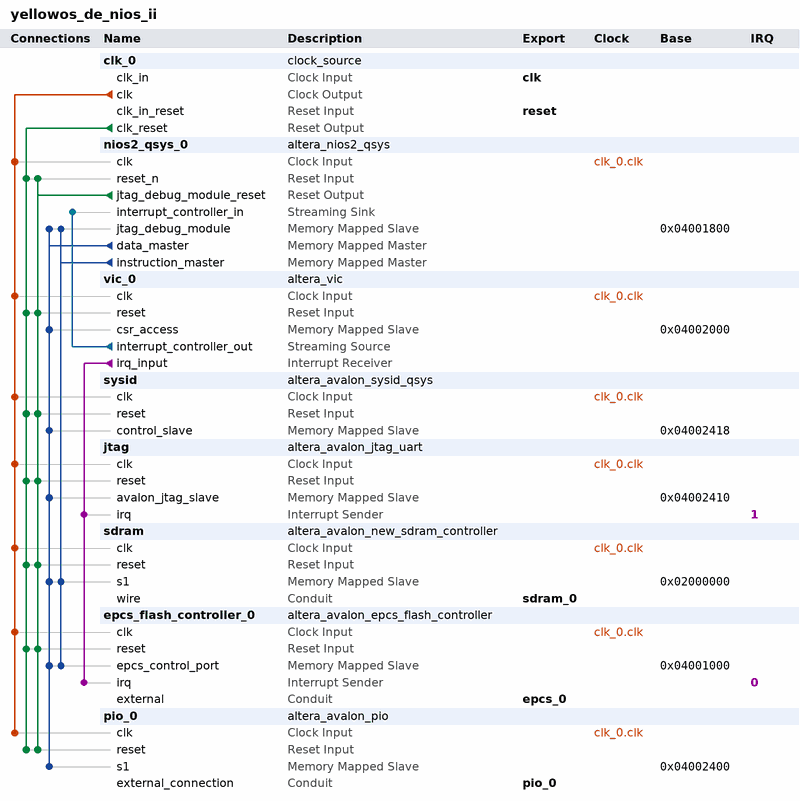
[diagram p0: system contents]
# Platform Designer (Qsys) system yellowos_de_nios_ii, Cyclone IV E EP4CE22F17C6
# Parameters at their usual value, and those the tool derives, are not listed.
package require -exact qsys 17.0
create_system yellowos_de_nios_ii
set_project_property DEVICE_FAMILY {Cyclone IV E}
set_project_property DEVICE EP4CE22F17C6

add_instance clk_0 clock_source 17.0
set_instance_parameter_value clk_0 clockFrequency 66666667

add_instance nios2_qsys_0 altera_nios2_qsys 16.1
set_instance_parameter_value nios2_qsys_0 breakSlave nios2_qsys_0.jtag_debug_module
set_instance_parameter_value nios2_qsys_0 exceptionSlave sdram.s1
set_instance_parameter_value nios2_qsys_0 icache_size 4096
set_instance_parameter_value nios2_qsys_0 impl Fast
set_instance_parameter_value nios2_qsys_0 mmu_TLBMissExcSlave None
set_instance_parameter_value nios2_qsys_0 resetSlave epcs_flash_controller_0.epcs_control_port
set_instance_parameter_value nios2_qsys_0 resetrequest_enabled true
set_instance_parameter_value nios2_qsys_0 setting_interruptControllerType External
set_instance_parameter_value nios2_qsys_0 setting_shadowRegisterSets 8

add_instance vic_0 altera_vic 17.0
set_instance_parameter_value vic_0 DAISY_CHAIN_ENABLE 0
set_instance_parameter_value vic_0 INTERRUPT_LATENCY_CYCLES 2
set_instance_parameter_value vic_0 NUMBER_OF_INT_PORTS 8
set_instance_parameter_value vic_0 OVERRIDE_INTERRUPT_LATENCY false
set_instance_parameter_value vic_0 RIL_WIDTH 4

add_instance sysid altera_avalon_sysid_qsys 17.0
set_instance_parameter_value sysid id 74496

add_instance jtag altera_avalon_jtag_uart 17.0
set_instance_parameter_value jtag simInteractiveOptions NO_INTERACTIVE_WINDOWS

add_instance sdram altera_avalon_new_sdram_controller 17.0
set_instance_parameter_value sdram TAC 5.5
set_instance_parameter_value sdram TRCD 20.0
set_instance_parameter_value sdram TRP 20.0
set_instance_parameter_value sdram casLatency 3
set_instance_parameter_value sdram columnWidth 9
set_instance_parameter_value sdram dataWidth 16
set_instance_parameter_value sdram generateSimulationModel false
set_instance_parameter_value sdram model single_Micron_MT48LC4M32B2_7_chip
set_instance_parameter_value sdram numberOfBanks 4
set_instance_parameter_value sdram numberOfChipSelects 1
set_instance_parameter_value sdram powerUpDelay 100.0
set_instance_parameter_value sdram refreshPeriod 15.625
set_instance_parameter_value sdram rowWidth 13

add_instance epcs_flash_controller_0 altera_avalon_epcs_flash_controller 17.0
set_instance_parameter_value epcs_flash_controller_0 resetrequest_enabled true

add_instance pio_0 altera_avalon_pio 17.0
set_instance_parameter_value pio_0 direction Output
set_instance_parameter_value pio_0 width 8

# connections
add_connection clk_0.clk epcs_flash_controller_0.clk clock
add_connection clk_0.clk jtag.clk clock
add_connection clk_0.clk nios2_qsys_0.clk clock
add_connection clk_0.clk pio_0.clk clock
add_connection clk_0.clk sdram.clk clock
add_connection clk_0.clk sysid.clk clock
add_connection clk_0.clk vic_0.clk clock
add_connection clk_0.clk_reset epcs_flash_controller_0.reset reset
add_connection clk_0.clk_reset jtag.reset reset
add_connection clk_0.clk_reset nios2_qsys_0.reset_n reset
add_connection clk_0.clk_reset pio_0.reset reset
add_connection clk_0.clk_reset sdram.reset reset
add_connection clk_0.clk_reset sysid.reset reset
add_connection clk_0.clk_reset vic_0.reset reset
add_connection nios2_qsys_0.jtag_debug_module_reset epcs_flash_controller_0.reset reset
add_connection nios2_qsys_0.jtag_debug_module_reset jtag.reset reset
add_connection nios2_qsys_0.jtag_debug_module_reset nios2_qsys_0.reset_n reset
add_connection nios2_qsys_0.jtag_debug_module_reset pio_0.reset reset
add_connection nios2_qsys_0.jtag_debug_module_reset sdram.reset reset
add_connection nios2_qsys_0.jtag_debug_module_reset sysid.reset reset
add_connection nios2_qsys_0.jtag_debug_module_reset vic_0.reset reset
add_connection nios2_qsys_0.data_master epcs_flash_controller_0.epcs_control_port avalon
set_connection_parameter_value nios2_qsys_0.data_master/epcs_flash_controller_0.epcs_control_port baseAddress 0x04001000
add_connection nios2_qsys_0.data_master jtag.avalon_jtag_slave avalon
set_connection_parameter_value nios2_qsys_0.data_master/jtag.avalon_jtag_slave baseAddress 0x04002410
add_connection nios2_qsys_0.data_master nios2_qsys_0.jtag_debug_module avalon
set_connection_parameter_value nios2_qsys_0.data_master/nios2_qsys_0.jtag_debug_module baseAddress 0x04001800
add_connection nios2_qsys_0.data_master pio_0.s1 avalon
set_connection_parameter_value nios2_qsys_0.data_master/pio_0.s1 baseAddress 0x04002400
add_connection nios2_qsys_0.data_master sdram.s1 avalon
set_connection_parameter_value nios2_qsys_0.data_master/sdram.s1 baseAddress 0x02000000
add_connection nios2_qsys_0.data_master sysid.control_slave avalon
set_connection_parameter_value nios2_qsys_0.data_master/sysid.control_slave baseAddress 0x04002418
add_connection nios2_qsys_0.data_master vic_0.csr_access avalon
set_connection_parameter_value nios2_qsys_0.data_master/vic_0.csr_access baseAddress 0x04002000
add_connection nios2_qsys_0.instruction_master epcs_flash_controller_0.epcs_control_port avalon
set_connection_parameter_value nios2_qsys_0.instruction_master/epcs_flash_controller_0.epcs_control_port baseAddress 0x04001000
add_connection nios2_qsys_0.instruction_master nios2_qsys_0.jtag_debug_module avalon
set_connection_parameter_value nios2_qsys_0.instruction_master/nios2_qsys_0.jtag_debug_module baseAddress 0x04001800
add_connection nios2_qsys_0.instruction_master sdram.s1 avalon
set_connection_parameter_value nios2_qsys_0.instruction_master/sdram.s1 baseAddress 0x02000000
add_connection vic_0.interrupt_controller_out nios2_qsys_0.interrupt_controller_in avalon_streaming
add_connection vic_0.irq_input epcs_flash_controller_0.irq interrupt
set_connection_parameter_value vic_0.irq_input/epcs_flash_controller_0.irq irqNumber 0
add_connection vic_0.irq_input jtag.irq interrupt
set_connection_parameter_value vic_0.irq_input/jtag.irq irqNumber 1

# exported interfaces
add_interface clk clock sink
set_interface_property clk EXPORT_OF clk_0.clk_in
add_interface epcs_0 conduit end
set_interface_property epcs_0 EXPORT_OF epcs_flash_controller_0.external
add_interface pio_0 conduit end
set_interface_property pio_0 EXPORT_OF pio_0.external_connection
add_interface reset reset sink
set_interface_property reset EXPORT_OF clk_0.clk_in_reset
add_interface sdram_0 conduit end
set_interface_property sdram_0 EXPORT_OF sdram.wire

set_interconnect_requirement {$system} qsys_mm.clockCrossingAdapter HANDSHAKE
set_interconnect_requirement {$system} qsys_mm.enableEccProtection FALSE
set_interconnect_requirement {$system} qsys_mm.insertDefaultSlave FALSE
set_interconnect_requirement {$system} qsys_mm.maxAdditionalLatency 1

save_system yellowos_de_nios_ii.qsys
